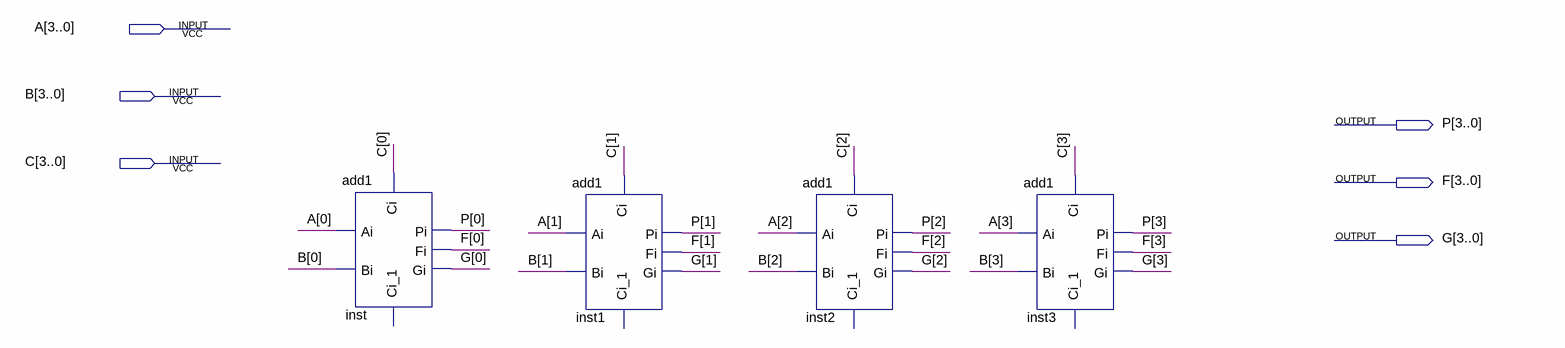
[diagram p0: schematic sheet]
// Quartus schematic 4fgp.bdf as structural Verilog: 4 symbols, 6 pins
module \4fgp  (
  input  [3:0] A,
  input  [3:0] B,
  input  [3:0] C,
  output [3:0] P,
  output [3:0] F,
  output [3:0] G
);

  add1 inst (.Ai(A[0]), .Bi(B[0]), .Ci(C[0]), .Fi(F[0]), .Pi(P[0]), .Gi(G[0]));  // open: Ci_1
  add1 inst1 (.Ai(A[1]), .Bi(B[1]), .Ci(C[1]), .Fi(F[1]), .Pi(P[1]), .Gi(G[1]));  // open: Ci_1
  add1 inst2 (.Ai(A[2]), .Bi(B[2]), .Ci(C[2]), .Fi(F[2]), .Pi(P[2]), .Gi(G[2]));  // open: Ci_1
  add1 inst3 (.Ai(A[3]), .Bi(B[3]), .Ci(C[3]), .Fi(F[3]), .Pi(P[3]), .Gi(G[3]));  // open: Ci_1
endmodule
